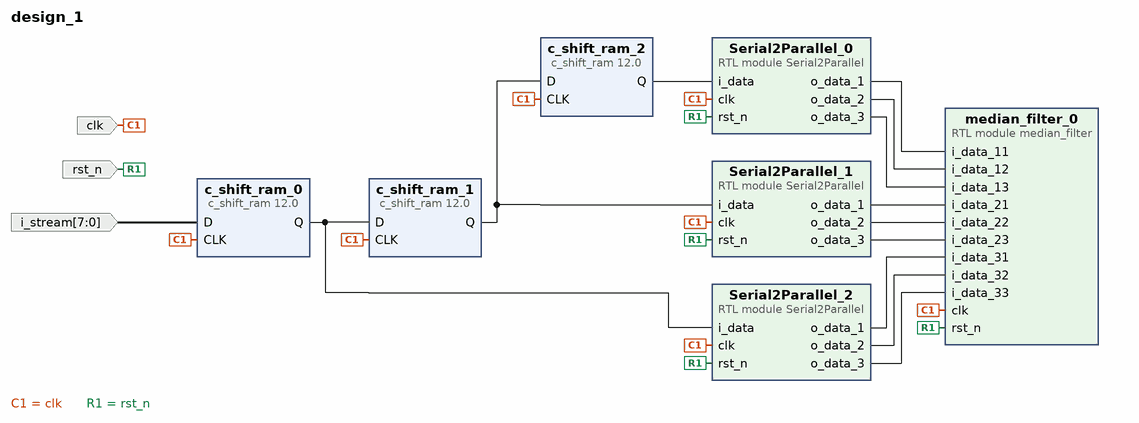
[diagram p0: block diagram of the top level]
# Vivado block design design_1, xc7z020clg400-2, Vivado 2018.3
create_bd_design design_1

create_bd_port -dir I -type clk clk
set_property -dict {CONFIG.FREQ_HZ 100000000} [get_bd_ports clk]
create_bd_port -dir I -type rst rst_n
create_bd_port -dir I -from 7 -to 0 -type data i_stream

create_bd_cell -type ip -vlnv xilinx.com:ip:c_shift_ram:12.0 c_shift_ram_0
set_property -dict [list \
  CONFIG.AsyncInitRadix 16 \
  CONFIG.AsyncInitVal 00 \
  CONFIG.DefaultData 00000000 \
  CONFIG.DefaultDataRadix 2 \
  CONFIG.Depth 600 \
  CONFIG.ReadMifFile false \
  CONFIG.SCLR false \
  CONFIG.SINIT false \
  CONFIG.SSET false \
  CONFIG.ShiftRegType Fixed_Length \
  CONFIG.Width 8 \
] [get_bd_cells c_shift_ram_0]
create_bd_cell -type ip -vlnv xilinx.com:ip:c_shift_ram:12.0 c_shift_ram_1
set_property -dict [list \
  CONFIG.AsyncInitRadix 16 \
  CONFIG.AsyncInitVal 00 \
  CONFIG.DefaultData 00000000 \
  CONFIG.DefaultDataRadix 2 \
  CONFIG.Depth 600 \
  CONFIG.ReadMifFile false \
  CONFIG.SCLR false \
  CONFIG.SINIT false \
  CONFIG.SSET false \
  CONFIG.ShiftRegType Fixed_Length \
  CONFIG.Width 8 \
] [get_bd_cells c_shift_ram_1]
create_bd_cell -type ip -vlnv xilinx.com:ip:c_shift_ram:12.0 c_shift_ram_2
set_property -dict [list \
  CONFIG.AsyncInitRadix 16 \
  CONFIG.AsyncInitVal 00 \
  CONFIG.DefaultData 00000000 \
  CONFIG.DefaultDataRadix 2 \
  CONFIG.Depth 600 \
  CONFIG.ReadMifFile false \
  CONFIG.SCLR false \
  CONFIG.SINIT false \
  CONFIG.SSET false \
  CONFIG.ShiftRegType Fixed_Length \
  CONFIG.Width 8 \
] [get_bd_cells c_shift_ram_2]
create_bd_cell -type module -reference median_filter median_filter_0
create_bd_cell -type module -reference Serial2Parallel Serial2Parallel_0
create_bd_cell -type module -reference Serial2Parallel Serial2Parallel_1
create_bd_cell -type module -reference Serial2Parallel Serial2Parallel_2

# ---- connections ----

connect_bd_net [get_bd_pins c_shift_ram_0/Q] [get_bd_pins c_shift_ram_1/D] [get_bd_pins Serial2Parallel_2/i_data]
connect_bd_net [get_bd_pins c_shift_ram_1/Q] [get_bd_pins c_shift_ram_2/D] [get_bd_pins Serial2Parallel_1/i_data]
connect_bd_net [get_bd_pins c_shift_ram_2/Q] [get_bd_pins Serial2Parallel_0/i_data]
connect_bd_net [get_bd_pins Serial2Parallel_0/o_data_1] [get_bd_pins median_filter_0/i_data_11]
connect_bd_net [get_bd_pins Serial2Parallel_0/o_data_2] [get_bd_pins median_filter_0/i_data_12]
connect_bd_net [get_bd_pins Serial2Parallel_0/o_data_3] [get_bd_pins median_filter_0/i_data_13]
connect_bd_net [get_bd_pins Serial2Parallel_1/o_data_1] [get_bd_pins median_filter_0/i_data_21]
connect_bd_net [get_bd_pins Serial2Parallel_1/o_data_2] [get_bd_pins median_filter_0/i_data_22]
connect_bd_net [get_bd_pins Serial2Parallel_1/o_data_3] [get_bd_pins median_filter_0/i_data_23]
connect_bd_net [get_bd_pins Serial2Parallel_2/o_data_1] [get_bd_pins median_filter_0/i_data_31]
connect_bd_net [get_bd_pins Serial2Parallel_2/o_data_2] [get_bd_pins median_filter_0/i_data_32]
connect_bd_net [get_bd_pins Serial2Parallel_2/o_data_3] [get_bd_pins median_filter_0/i_data_33]
connect_bd_net [get_bd_ports clk] \
  [get_bd_pins median_filter_0/clk] [get_bd_pins c_shift_ram_2/CLK] [get_bd_pins c_shift_ram_1/CLK] \
  [get_bd_pins c_shift_ram_0/CLK] [get_bd_pins Serial2Parallel_0/clk] [get_bd_pins Serial2Parallel_1/clk] \
  [get_bd_pins Serial2Parallel_2/clk]
connect_bd_net [get_bd_ports rst_n] \
  [get_bd_pins median_filter_0/rst_n] [get_bd_pins Serial2Parallel_0/rst_n] [get_bd_pins Serial2Parallel_1/rst_n] \
  [get_bd_pins Serial2Parallel_2/rst_n]
connect_bd_net [get_bd_ports i_stream] [get_bd_pins c_shift_ram_0/D]

validate_bd_design
save_bd_design
